# Altium schematic sheet ISO_COMMUNICATION.SchDoc: ISO_COMMUNICATION
size 420 x 297 mm; SheetNumber: 5; SheetTotal: 11
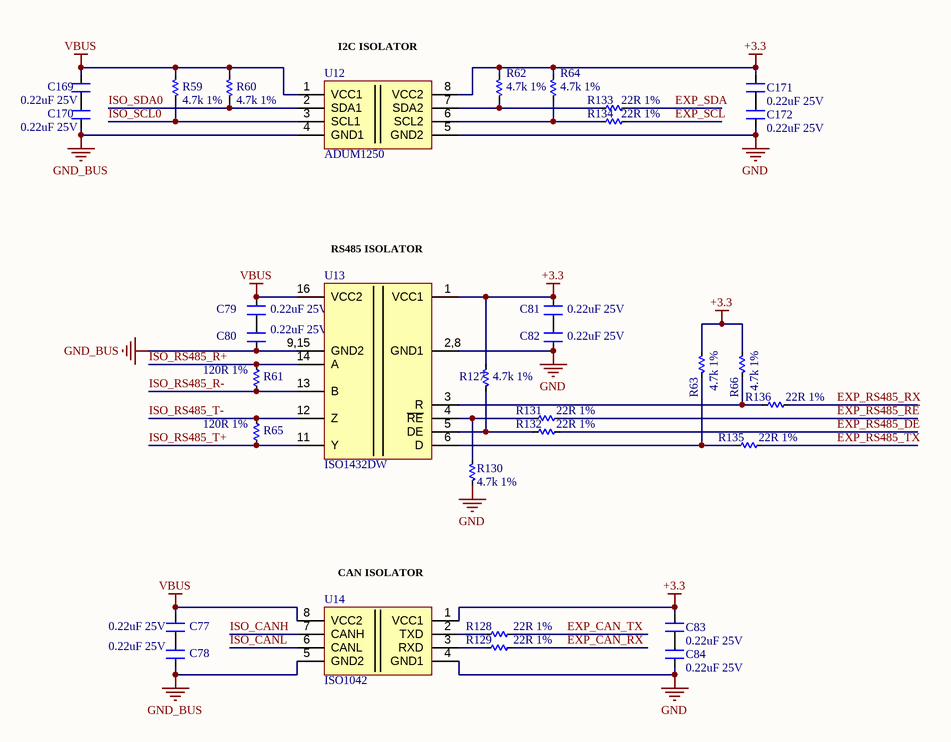
[diagram p0: ISO_COMMUNICATION.SchDoc]

## Parts
C77  0.22uF 25V  [CN-SMD-0603]
C78  0.22uF 25V  [CN-SMD-0603]
C79  0.22uF 25V  [CN-SMD-0603]
C80  0.22uF 25V  [CN-SMD-0603]
C81  0.22uF 25V  [CN-SMD-0603]
C82  0.22uF 25V  [CN-SMD-0603]
C83  0.22uF 25V  [CN-SMD-0603]
C84  0.22uF 25V  [CN-SMD-0603]
C169  0.22uF 25V  [CN-SMD-0603]
C170  0.22uF 25V  [CN-SMD-0603]
C171  0.22uF 25V  [CN-SMD-0603]
C172  0.22uF 25V  [CN-SMD-0603]
R59  4.7k 1%  [RES-SMD-0603]
R60  4.7k 1%  [RES-SMD-0603]
R61  120R 1%  [RES-SMD-0603]
R62  4.7k 1%  [RES-SMD-0603]
R63  4.7k 1%  [RES-SMD-0603]
R64  4.7k 1%  [RES-SMD-0603]
R65  120R 1%  [RES-SMD-0603]
R66  4.7k 1%  [RES-SMD-0603]
R127  4.7k 1%  [RES-SMD-0603]
R128  22R 1%  [RES-SMD-0603]
R129  22R 1%  [RES-SMD-0603]
R130  4.7k 1%  [RES-SMD-0603]
R131  22R 1%  [RES-SMD-0603]
R132  22R 1%  [RES-SMD-0603]
R133  22R 1%  [RES-SMD-0603]
R134  22R 1%  [RES-SMD-0603]
R135  22R 1%  [RES-SMD-0603]
R136  22R 1%  [RES-SMD-0603]
U12  ADUM1250  [SOIC-8]
U13  ISO1432DW  [SOIC-16]
U14  ISO1042  [SOIC-8]

## Nets
+3.3: C81.2 C83.2 C171.2 R62.2 R63.2 R64.2 R66.2 R127.2 U12.8(VCC2) U13.1(VCC1) U14.1(VCC1)
GND: C82.1 C84.1 C172.1 R130.2 U12.5(GND2) U13.2,8(GND1) U14.4(GND1)
GND_BUS: C78.1 C80.1 C170.1 U12.4(GND1) U13.9,15(GND2) U14.5(GND2)
VBUS: C77.2 C79.2 C169.2 R59.2 R60.2 U12.1(VCC1) U13.16(VCC2) U14.8(VCC2)
EXP_CAN_RX: R129.2
EXP_CAN_TX: R128.2
EXP_RS485_DE: R132.2
EXP_RS485_~{RE}: R131.2
EXP_RS485_RX: R136.2
EXP_RS485_TX: R135.2
EXP_SCL: R134.2
EXP_SDA: R133.2
ISO_CANH: U14.7(CANH)
ISO_CANL: U14.6(CANL)
ISO_RS485_R+: R61.2 U13.14(A)
ISO_RS485_R-: R61.1 U13.13(B)
ISO_RS485_T+: R65.1 U13.11(Y)
ISO_RS485_T-: R65.2 U13.12(Z)
ISO_SCL0: R59.1 U12.3(SCL1)
ISO_SDA0: R60.1 U12.2(SDA1)
NetC77_1: C77.1 C78.2
NetC79_1: C79.1 C80.2
NetC81_1: C81.1 C82.2
NetC83_1: C83.1 C84.2
NetC169_1: C169.1 C170.2
NetC171_1: C171.1 C172.2
NetR62_1: R62.1 R133.1 U12.7(SDA2)
NetR63_1: R63.1 R135.1 U13.6(D)
NetR64_1: R64.1 R134.1 U12.6(SCL2)
NetR66_1: R66.1 R136.1 U13.3(R)
NetR127_1: R127.1 R132.1 U13.5(DE)
NetR128_1: R128.1 U14.2(TXD)
NetR129_1: R129.1 U14.3(RXD)
NetR130_1: R130.1 R131.1 U13.4(~{RE})

## Notes on the sheet
- (near U12) I2C ISOLATOR
- (near U13) RS485 ISOLATOR
- (near U14) CAN ISOLATOR
- Project:
- BEE-PC1
- Sub-system:
- NANORACK_EXP_CONTROLLER
- Design by:
- SANG HUYNH
- BAO BUI Q.
- Sheet title:
- Sheet
- A3
- of
- Checked by:
- Approved by:
- VU PHAM
- Revision:
- Document No:
- V1.0.0
- Size:
- Date:
- 01/10/2024

## Library data of the parts
C77-C84 C169-C172 = Capacitors: Value: 33pF
R59-R66 R127-R136 = Res SMD: SMD; Manufacturer: Generic Components; Class: Passive; Published: 08/06/2000; Publisher: Altium Hobart Technology Centre
U13 = ISO1432DW: IC TXRX/ISO FULL 1/1 16SOIC
U14 = ISO1042: IC TRANSCEIVER FULL 1/1 8SOIC